# Altium project ADCS.PrjPcb (part 1 of 2)
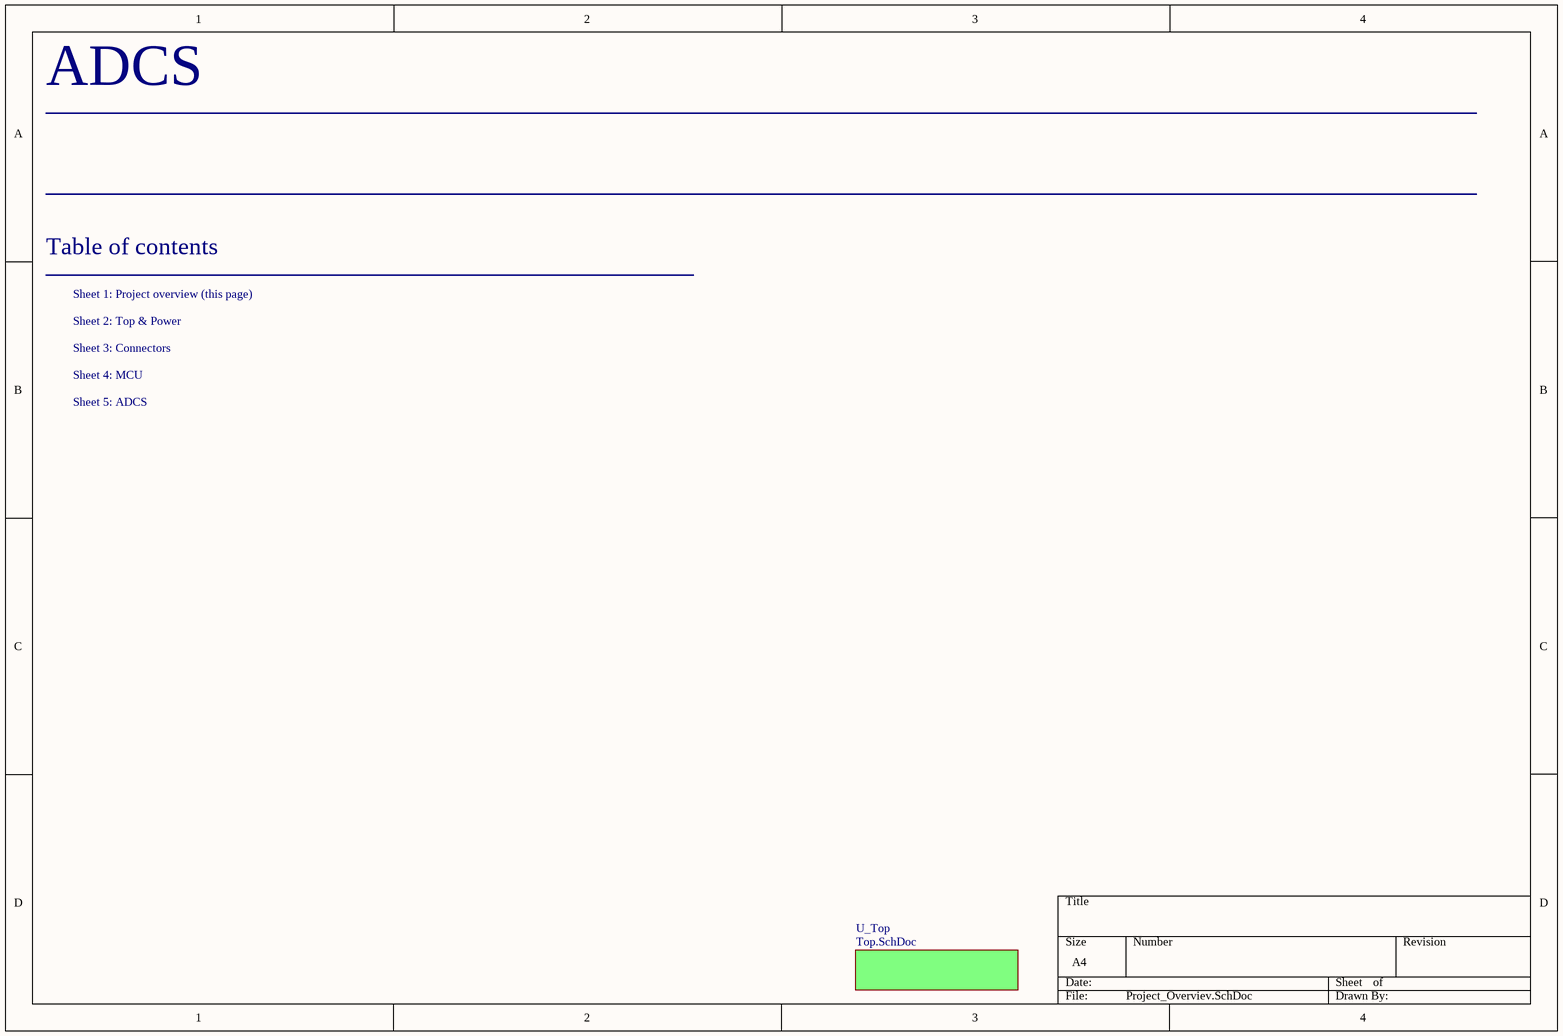
[diagram p0: Project_Overviev.SchDoc]
5 sheets, 100 parts. Net scope: flat (ports and power ports of the same name join across sheets).
Board file: ADCS.PcbDoc
Sheets:
  Project_Overviev.SchDoc
    U_Top = Top.SchDoc
      AOCS_Add-on = ADCS.SchDoc
      ADCS_Connectors = Connectors.SchDoc
      AOCS_MCU_446 = MCU.SchDoc

## Sheet Project_Overviev.SchDoc
size A4; SheetNumber: 1; SheetTotal: 5

### Sub-sheets
U_Top = Top.SchDoc: no entries

### Notes on the sheet
- ADCS
- Table of contents
- Sheet 1: Project overview (this page)
- Sheet 2: Top & Power
- Sheet 3: Connectors
- Sheet 4: MCU
- Sheet 5: ADCS

## Sheet Top.SchDoc
size A4; SheetNumber: 2; SheetTotal: 5
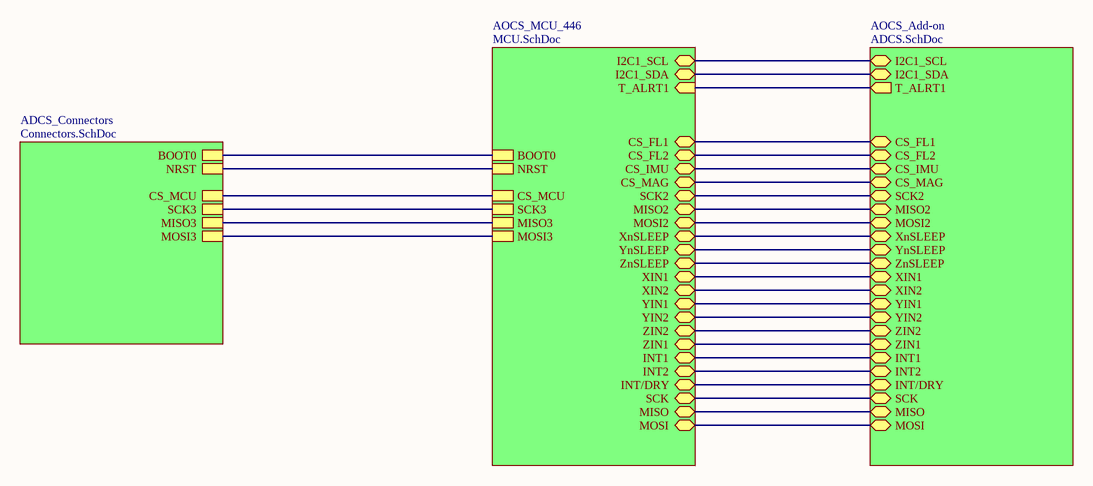
[diagram p1: Top.SchDoc]

### Sub-sheets
ADCS_Connectors = Connectors.SchDoc: NRST, BOOT0, CS_MCU, SCK3, MISO3, MOSI3
AOCS_Add-on = ADCS.SchDoc: I2C1_SCL (bidir), I2C1_SDA (bidir), T_ALRT1 (out), CS_FL2 (bidir), CS_FL1 (bidir), CS_IMU (bidir), CS_MAG (bidir), SCK2 (bidir), MISO2 (bidir), MOSI2 (bidir), YnSLEEP (bidir), XnSLEEP (bidir), ZnSLEEP (bidir), XIN1 (bidir), XIN2 (bidir), YIN1 (bidir), YIN2 (bidir), ZIN2 (bidir), INT2 (bidir), ZIN1 (bidir), INT1 (bidir), INT/DRY (bidir), SCK (bidir), MISO (bidir), MOSI (bidir)
AOCS_MCU_446 = MCU.SchDoc: NRST, BOOT0, I2C1_SCL (bidir), I2C1_SDA (bidir), CS_FL2 (bidir), CS_FL1 (bidir), CS_IMU (bidir), CS_MAG (bidir), SCK2 (bidir), MISO2 (bidir), T_ALRT1 (in), CS_MCU, SCK3, MISO3, MOSI3, MOSI2 (bidir), XnSLEEP (bidir), YnSLEEP (bidir), ZnSLEEP (bidir), XIN1 (bidir), XIN2 (bidir), YIN1 (bidir), YIN2 (bidir), ZIN2 (bidir), INT1 (bidir), ZIN1 (bidir), INT2 (bidir), INT/DRY (bidir), SCK (bidir), MOSI (bidir), MISO (bidir)

### Nets
(unnamed): sheet AOCS_Add-on/I2C1_SCL, sheet AOCS_MCU_446/I2C1_SCL
(unnamed): sheet AOCS_Add-on/I2C1_SDA, sheet AOCS_MCU_446/I2C1_SDA
(unnamed): sheet AOCS_Add-on/T_ALRT1, sheet AOCS_MCU_446/T_ALRT1
(unnamed): sheet AOCS_Add-on/CS_FL2, sheet AOCS_MCU_446/CS_FL2
(unnamed): sheet AOCS_Add-on/CS_FL1, sheet AOCS_MCU_446/CS_FL1
(unnamed): sheet AOCS_Add-on/CS_IMU, sheet AOCS_MCU_446/CS_IMU
(unnamed): sheet AOCS_Add-on/CS_MAG, sheet AOCS_MCU_446/CS_MAG
(unnamed): sheet AOCS_Add-on/SCK2, sheet AOCS_MCU_446/SCK2
(unnamed): sheet AOCS_Add-on/MISO2, sheet AOCS_MCU_446/MISO2
(unnamed): sheet AOCS_Add-on/MOSI2, sheet AOCS_MCU_446/MOSI2
(unnamed): sheet AOCS_Add-on/YnSLEEP, sheet AOCS_MCU_446/YnSLEEP
(unnamed): sheet AOCS_Add-on/XnSLEEP, sheet AOCS_MCU_446/XnSLEEP
(unnamed): sheet AOCS_Add-on/ZnSLEEP, sheet AOCS_MCU_446/ZnSLEEP
(unnamed): sheet AOCS_Add-on/XIN1, sheet AOCS_MCU_446/XIN1
(unnamed): sheet AOCS_Add-on/XIN2, sheet AOCS_MCU_446/XIN2
(unnamed): sheet AOCS_Add-on/YIN1, sheet AOCS_MCU_446/YIN1
(unnamed): sheet AOCS_Add-on/YIN2, sheet AOCS_MCU_446/YIN2
(unnamed): sheet AOCS_Add-on/ZIN2, sheet AOCS_MCU_446/ZIN2
(unnamed): sheet AOCS_Add-on/INT2, sheet AOCS_MCU_446/INT2
(unnamed): sheet AOCS_Add-on/ZIN1, sheet AOCS_MCU_446/ZIN1
(unnamed): sheet AOCS_Add-on/INT1, sheet AOCS_MCU_446/INT1
(unnamed): sheet AOCS_Add-on/INT/DRY, sheet AOCS_MCU_446/INT/DRY
(unnamed): sheet AOCS_Add-on/SCK, sheet AOCS_MCU_446/SCK
(unnamed): sheet AOCS_Add-on/MISO, sheet AOCS_MCU_446/MISO
(unnamed): sheet AOCS_Add-on/MOSI, sheet AOCS_MCU_446/MOSI
(unnamed): sheet ADCS_Connectors/NRST, sheet AOCS_MCU_446/NRST
(unnamed): sheet ADCS_Connectors/BOOT0, sheet AOCS_MCU_446/BOOT0
(unnamed): sheet ADCS_Connectors/CS_MCU, sheet AOCS_MCU_446/CS_MCU
(unnamed): sheet ADCS_Connectors/SCK3, sheet AOCS_MCU_446/SCK3
(unnamed): sheet ADCS_Connectors/MISO3, sheet AOCS_MCU_446/MISO3
(unnamed): sheet ADCS_Connectors/MOSI3, sheet AOCS_MCU_446/MOSI3

## Sheet ADCS.SchDoc
size A4; SheetNumber: 5; SheetTotal: 5
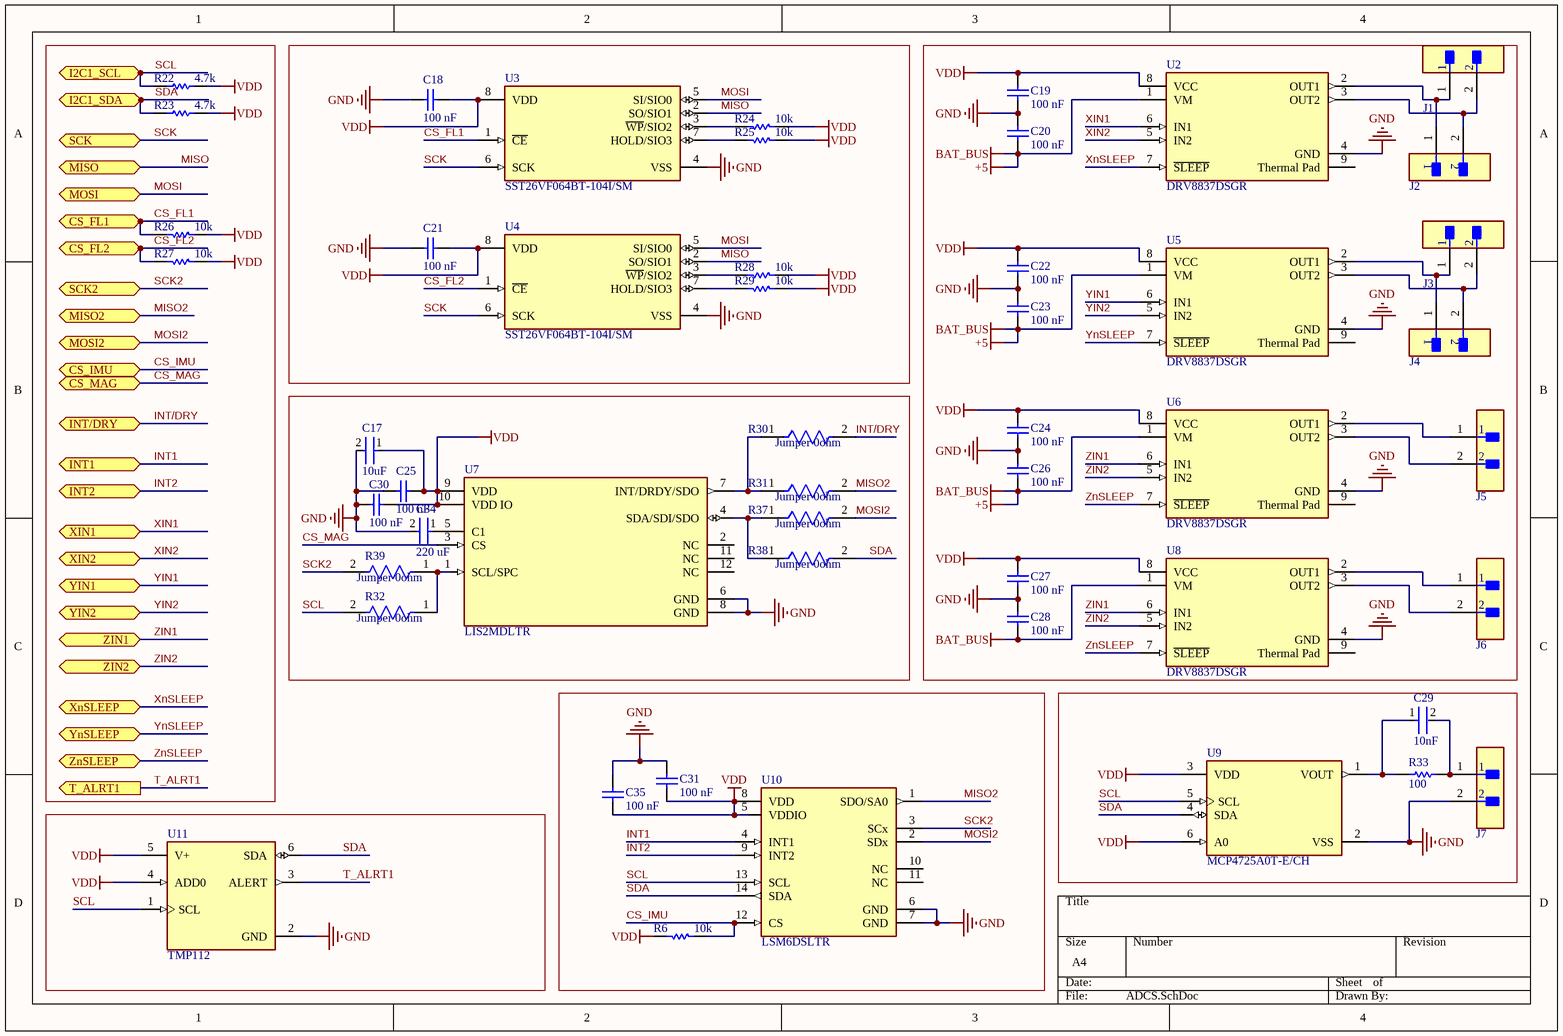
[diagram p2: ADCS.SchDoc]

### Parts
C17  10uF  [FP-CL21B106KOQNNNG-MFG]
C18  100 nF  [CAPC1050X55X23ML05T13]
C19  100 nF  [CAPC1050X55X23ML05T13]
C20  100 nF  [CAPC1050X55X23ML05T13]
C21  100 nF  [CAPC1050X55X23ML05T13]
C22  100 nF  [CAPC1050X55X23ML05T13]
C23  100 nF  [CAPC1050X55X23ML05T13]
C24  100 nF  [CAPC1050X55X23ML05T13]
C25  100 nF  [CAPC1050X55X23ML05T13]
C26  100 nF  [CAPC1050X55X23ML05T13]
C27  100 nF  [CAPC1050X55X23ML05T13]
C28  100 nF  [CAPC1050X55X23ML05T13]
C29  10nF  [FP-CL165-IPC_C]
C30  100 nF  [CAPC1050X55X23ML05T13]
C31  100 nF  [CAPC1050X55X23ML05T13]
C34  220 uF  [FP-C0603C-CF-MFG]
C35  100 nF  [CAPC1050X55X23ML05T13]
J1  B2B-XH-A(LF)(SN)  [FP-B2B-XH-A_LF_SN-MFG]  (value not drawn)
J2  B2B-XH-A(LF)(SN)  [FP-B2B-XH-A_LF_SN-MFG]  (value not drawn)
J3  B2B-XH-A(LF)(SN)  [FP-B2B-XH-A_LF_SN-MFG]  (value not drawn)
J4  B2B-XH-A(LF)(SN)  [FP-B2B-XH-A_LF_SN-MFG]  (value not drawn)
J5  B2B-XH-A(LF)(SN)  [FP-B2B-XH-A_LF_SN-MFG]  (value not drawn)
J6  B2B-XH-A(LF)(SN)  [FP-B2B-XH-A_LF_SN-MFG]  (value not drawn)
J7  B2B-XH-A(LF)(SN)  [FP-B2B-XH-A_LF_SN-MFG]  (value not drawn)
R6  10k  [RESC1005X40X25LL05T05]
R22  4.7k  [RESC1005X40X25LL05T05]
R23  4.7k  [RESC1005X40X25LL05T05]
R24  10k  [RESC1005X40X25LL05T05]
R25  10k  [RESC1005X40X25LL05T05]
R26  10k  [RESC1005X40X25LL05T05]
R27  10k  [RESC1005X40X25LL05T05]
R28  10k  [RESC1005X40X25LL05T05]
R29  10k  [RESC1005X40X25LL05T05]
R30  Jumper 0ohm  [FP-RC1206-MFG]
R31  Jumper 0ohm  [FP-RC1206-MFG]
R32  Jumper 0ohm  [FP-RC1206-MFG]
R33  100  [RESC1608X55X30LL15T15]
R37  Jumper 0ohm  [FP-RC1206-MFG]
R38  Jumper 0ohm  [FP-RC1206-MFG]
R39  Jumper 0ohm  [FP-RC1206-MFG]
U2  DRV8837DSGR  [FP-DSG0008A-MFG]
U3  SST26VF064BT-104I/SM  [FP-C04-056-IPC_A]
U4  SST26VF064BT-104I/SM  [FP-C04-056-IPC_A]
U5  DRV8837DSGR  [FP-DSG0008A-MFG]
U6  DRV8837DSGR  [FP-DSG0008A-MFG]
U7  LIS2MDLTR  [FP-LGA-12-DM00170568-MFG]
U8  DRV8837DSGR  [FP-DSG0008A-MFG]
U9  MCP4725A0T-E/CH  [FP-C04-028-CHY-IPC_A]
U10  LSM6DSLTR  [FP-LGA-14L-DM00249496-MFG]
U11  TMP112  [FP-DRL0006A-MFG]

### Ports
CS_FL1 (bidir, see Top[3B], MCU[2B]), CS_FL2 (bidir, see Top[3B], MCU[2B]), CS_IMU (bidir, see Top[3B], MCU[2B]), CS_MAG (bidir, see Top[3B], MCU[2B]), I2C1_SCL (bidir, see Top[3B], MCU[2B]), I2C1_SDA (bidir, see Top[3B], MCU[2B]), INT1 (bidir, see Top[3C], MCU[3A]), INT2 (bidir, see Top[3C], MCU[3A]), INT/DRY (bidir, see Top[3C], MCU[3A]), MISO2 (bidir, see Top[3B], MCU[2C]), MISO (bidir, see Top[3C], MCU[2A]), MOSI2 (bidir, see Top[3C], MCU[2C]), MOSI (bidir, see Top[3C], MCU[2A]), SCK2 (bidir, see Top[3B], MCU[2B]), SCK (bidir, see Top[3C], MCU[2A]), T_ALRT1 (out, see Top[3B], MCU[3A]), XIN1 (bidir, see Top[3C], MCU[3A]), XIN2 (bidir, see Top[3C], MCU[3A]), XnSLEEP (bidir, see Top[3C], MCU[2A]), YIN1 (bidir, see Top[3C], MCU[3A]), YIN2 (bidir, see Top[3C], MCU[3A]), YnSLEEP (bidir, see Top[3C], MCU[2A]), ZIN1 (bidir, see Top[3C], MCU[2A]), ZIN2 (bidir, see Top[3C], MCU[2A]), ZnSLEEP (bidir, see Top[3C], MCU[2B])

### Nets
+5: C20.1 C23.1 C26.1 C28.1 U2.1(VM) U5.1(VM) U6.1(VM) U8.1(VM)  [also labelled BAT_BUS]
GND: C17.2 C18.1 C19.2 C20.2 C21.1 C22.2 C23.2 C24.2 C25.1 C26.2 C27.2 C28.2 C30.1 C31.2 C34.2 C35.2 J7.2 U2.4(GND) U3.4(VSS) U4.4(VSS) U5.4(GND) U6.4(GND) U7.6(GND) U7.8(GND) U8.4(GND) U9.2(VSS) U10.6(GND) U10.7(GND) U11.2(GND)
VDD: C17.1 C18.2 C19.1 C21.2 C22.1 C24.1 C25.2 C27.1 C30.2 C31.1 C35.1 R6.2 R22.2 R23.2 R24.1 R25.1 R26.1 R27.1 R28.1 R29.1 U2.8(VCC) U3.8(VDD) U4.8(VDD) U5.8(VCC) U6.8(VCC) U7.9(VDD) U7.10(VDD_IO) U8.8(VCC) U9.3(VDD) U9.6(A0) U10.5(VDDIO) U10.8(VDD) U11.4(ADD0) U11.5(V+)
CS_FL1: R26.2 U3.1(~{CE}) ; port CS_FL1
CS_FL2: R27.2 U4.1(~{CE}) ; port CS_FL2
CS_IMU: R6.1 U10.12(CS) ; port CS_IMU
CS_MAG: U7.3(CS) ; port CS_MAG
INT1: U10.4(INT1) ; port INT1
INT2: U10.9(INT2) ; port INT2
INT/DRY: R30.2 ; port INT/DRY
MISO: U3.2(SO/SIO1) U4.2(SO/SIO1) ; port MISO
MISO2: R31.2 U10.1(SDO/SA0) ; port MISO2
MOSI: U3.5(SI/SIO0) U4.5(SI/SIO0) ; port MOSI
MOSI2: R37.2 U10.2(SDx) ; port MOSI2
SCK: U3.6(SCK) U4.6(SCK) ; port SCK
SCK2: R39.2 U10.3(SCx) ; port SCK2
SCL: R22.1 R32.2 U9.5(SCL) U10.13(SCL) U11.1(SCL) ; port I2C1_SCL
SDA: R23.1 R38.2 U9.4(SDA) U10.14(SDA) U11.6(SDA) ; port I2C1_SDA
T_ALRT1: U11.3(ALERT) ; port T_ALRT1
XIN1: U2.6(IN1) ; port XIN1
XIN2: U2.5(IN2) ; port XIN2
XnSLEEP: U2.7(~{SLEEP}) ; port XnSLEEP
YIN1: U5.6(IN1) ; port YIN1
YIN2: U5.5(IN2) ; port YIN2
YnSLEEP: U5.7(~{SLEEP}) ; port YnSLEEP
ZIN1: U6.6(IN1) U8.6(IN1) ; port ZIN1
ZIN2: U6.5(IN2) U8.5(IN2) ; port ZIN2
ZnSLEEP: U6.7(~{SLEEP}) U8.7(~{SLEEP}) ; port ZnSLEEP
NetC29_1: C29.1 R33.1 U9.1(VOUT)
NetC29_2: C29.2 J7.1 R33.2
NetC34_1: C34.1 U7.5(C1)
NetJ1_1: J1.1 J2.1 U2.2(OUT1)
NetJ1_2: J1.2 J2.2 U2.3(OUT2)
NetJ3_1: J3.1 J4.1 U5.2(OUT1)
NetJ3_2: J3.2 J4.2 U5.3(OUT2)
NetJ5_1: J5.1 U6.2(OUT1)
NetJ5_2: J5.2 U6.3(OUT2)
NetJ6_1: J6.1 U8.2(OUT1)
NetJ6_2: J6.2 U8.3(OUT2)
NetR24_2: R24.2 U3.3(~{WP}/SIO2)
NetR25_2: R25.2 U3.7(HOLD/SIO3)
NetR28_2: R28.2 U4.3(~{WP}/SIO2)
NetR29_2: R29.2 U4.7(HOLD/SIO3)
NetR30_1: R30.1 R31.1 U7.7(INT/DRDY/SDO)
NetR32_1: R32.1 R39.1 U7.1(SCL/SPC)
NetR37_1: R37.1 R38.1 U7.4(SDA/SDI/SDO)

Not connected (* = marked no-connect by the designer): U2 9(Thermal_Pad); U5 9(Thermal_Pad); U6 9(Thermal_Pad); U7 2(NC) 11(NC) 12(NC); U8 9(Thermal_Pad); U10 10(NC) 11(NC)

### Library data of the parts
C17 = CMP-13271-000015-1: CAP CER 10UF 16V X7R 0805; Manufacturer Part Number: CL21B106KOQNNNG; Manufacturer: Samsung Electro-Mechanics; Temperature Coefficient: 15%; Tolerance: 10%; Material: Ceramic; ComponentLink2URL: http://product.samsungsem.com/mlcc/CL21B106KOQNNN.do; Package: 0; Voltage Rating: 16V; Value: 10uF; Height: 1.4mm; Temperature Characteristic: X7R; Category: Cap; Lead Free: Yes; RoHS: TRUE; ComponentLink2Description: Datasheet; Octopart: https://octopart.com/cl21b106koqnnng-samsung-19995691; Device Class L1: Passive Components; Temperature Range Low: -55°C; Device Class L3: Ceramic Capacitors; Ipc Land Pattern Name: CAPC200125X125; Digikey Description: CAP CER 10UF 16V X7R 0805; Automotive: No; Capacitance: 10uF; Temperature Range High: +125°C; Device Class L2: Capacitors; Temperature: -55°C to +125°C
C18-C28 C30 C31 C35 = CMP-2000-05439-1: Chip Capacitor, 100 nF, +/- 10%, 16 V, -55 to 125 degC, 0402 (1005 Metric), RoHS, Tape and Reel; Manufacturer: Samsung Electro-Mechanics; Capacitance: 100000pF; Dielectric: X7R; Rated Voltage: 16V; Case Size/Dimension: 0402; Tolerance (%): ±10%; Manufacturer URL: http://www.samsungsem.com/global/index.jsp; Datasheet URL: https://datasheet.ciiva.com/29198/458718-da-01-en-vs-kondensator-0402-29198423.pdf; Datasheet Version: Nov-10
C29 = CMP-13271-000387-1: Cap Ceramic 10nF 50V X7R ±10% SMD 0402 +125°C Paper T/R; Depth: 0.5mm; Length: 1mm; Lead Free: Lead Free; Case Code (Metric): 1005; Width: 0.02inch; Min Operating Temperature: -55°C; Thickness: 0.022inch; Package Quantity: 1; Mount: Surface Mount; Height: 0.5mm; Voltage: 50V; Material: Ceramic; Tolerance: 10%; Case Code (Imperial): 0402; Radiation Hardening: No; Case/Package: 0402; Max Operating Temperature: 125°C; Voltage Rating (DC): 50V; Contact Plating: Tin; Packaging: Tape and Reel; Voltage Rating: 50V; Capacitance: 10nF; Dielectric: X7R
C34 = CMP-03020-018700-1: CAP CER 0603 .22UF 10V X7R 20% A; Manufacturer Part Number: C0603C224M8RACAUTO; Manufacturer: KEMET; Tolerance: 0.2; Automotive Grade: Grade 1; Value: 0.22 μF; Temperature Coefficient: 30ppm/°C; Material: Ceramic; Automotive: Yes; Temperature Characteristic: X7R; Height: 0.87mm; Digikey Description: CAP CER 0603 .22UF 10V X7R 20% A; Lead Free: Yes; Octopart: https://octopart.com/c0603c224m8racauto-kemet-75357852; Package: C0603C-CF; RoHS: TRUE; Category: Cap; Device Class L2: Capacitors; Voltage Rating: 10 V; Temperature Range High: +125°C; Device Class L3: Ceramic Capacitors; ComponentLink2URL: https://api.kemet.com/component-edge/download/datasheet/C0603C100J5GACAUTO.pdf; ComponentLink2Description: Datasheet; Temperature Range Low: -55°C; Capacitance: 0.22 μF; Device Class L1: Passive Components; Temperature: -55°C to +125°C
J1-J7 = CMP-2000-05888-3: CONN HEADER VERT 2POS 2.5MM; Current Rating: 3A; Voltage Rating: 250V; Number of Contacts: 2; Contact Resistance: 20mR; Wire/Cable Gauge: 22AWG; Insulation Resistance: 1GR; Connector Type: Male Pin; Packaging: Bulk; Contact Material: Brass; Lead Free: Lead Free; Orientation: Straight; Contact Plating: Tin; Max Current Rating: 3A; Termination: Solder; Fastening Type: Detent; Depth: 5.75mm; Housing Material: Polyamide; REACH SVHC: No SVHC; Series: XH; Voltage Rating (AC): 250V; Number of Positions: 2; Color: Natural; Contact Type: Male Pin; Max Voltage Rating (DC): 250V; Pitch: 2.5mm; Lead Pitch: 2.5mm; Mount: Through Hole; Max Operating Temperature: 85°C; Length: 7.4mm; Max Voltage Rating (AC): 250V; Min Operating Temperature: -25°C; Number of Rows: 1; Housing Color: White
R6 R24-R29 = CMP-2000-07588-1: Chip Resistor, 10 KOhm, +/- 1%, 0.1 W, -55 to 155 degC, 0402 (1005 Metric), RoHS, Tape and Reel; Manufacturer: Panasonic; Power Rating: 100mW; Voltage Rating: 50V; Resistance: 10KOhm; Case\/Package: 0402; Temperature Coefficient: 100ppm\/degreesC; RoHSCompliant: True; Lead Free: LeadFree; Package Quantity: 1; Contact Plating: Tin; Length: 1mm; Radiation Hardening: No; REACH SVHC: NoSVHC; Max Operating Temperature: 155degC; Depth: 0.5mm; Case Code (Imperial): 0402; Military Standard: Not; Package Description: 2-Pin Surface Mount Device, Body 1 x 0.5 mm; Termination: SMD/SMT; Case Code (Metric): 1005; Height: 0.35mm; Packaging: TapeandReel; Voltage Rating (DC): 50V; Package Reference: 402; Number of Pins: 2; Tolerance: 1%; Mounting Technology: SurfaceMount; Width: 0.02inch; Mount: SurfaceMount; Datasheet URL: https://industrial.panasonic.com/cdbs/www-data/pdf/RDA0000/AOA0000C304.pdf; Composition: ThickFilm; Datasheet Version: 02/2017; Manufacturer URL: http://www.panasonic.com/; Max Power Dissipation: 100mW; Number of Terminations: 2; Min Operating Temperature: -55degC
R22 R23 = CMP-2002-01154-4: Chip Resistor, 4.7 KOhm, +/- 1%, 0.1 W, -55 to 155 degC, 0402 (1005 Metric), RoHS, Tape and Reel; PartNumber: ERJ-2RKF4701X; Voltage Rating: 50 V; Case\/Package: 0402; Power Rating: 100 mW; Height: 0.35 mm; Mounting Technology: Surface Mount; REACH SVHC: Yes; Resistance: 4.7 KOhm; Max Operating Temperature: 155 degC; ComponentLink1Description: Manufacturer URL; ComponentLink2Description: Datasheet; Pins: 2; PackageReference: 0402; Tolerance: 1%; Case Code (Imperial): 0402; Length: 1 mm; PackageDescription: 2-Pin Surface Mount Device, Body 1 x 0.5 mm; RoHSCompliant: true; Package Quantity: 1; Radiation Hardening: No; DatasheetVersion: 04/2015; Width: 0.5 mm; Case Code (Metric): 1005; Mount: Surface Mount; ComponentLink1URL: http://www.panasonic.com/; Min Operating Temperature: -55 degC; Packaging: Cut Tape; ComponentLink2URL: http://industrial.panasonic.com/cdbs/www-data/pdf/RDA0000/AOA0000C86.pdf
R30-R32 R37-R39 = CMP-2100-03681-2: RES SMD 0 OHM JUMPER 1/4W 1206; Manufacturer Part Number: RC1206JR-070RL; Manufacturer: YAGEO; Voltage Rating: 200V; Temperature Coefficient: 300ppm/°C; Power Rating: 0.25W; Value: 0Ω; Tolerance: 5%; Temperature Range Low: -55°C; Category: Res; Automotive: No; Ipc Land Pattern Name: RESC310160X55; Device Class L1: Passive Components; Temperature: -55°C to +155°C; ComponentLink2URL: https://www.yageo.com/upload/media/product/productsearch/datasheet/rchip/PYu-RC_Group_51_RoHS_L_10.pdf; Lead Free: Yes; Height: 0.65mm; Footprint Url: https://www.yageo.com/upload/website/yageo_PYu-R_Mount_10_19050818_343.pdf; Package: RC1206; Digikey Description: RES SMD 0 OHM JUMPER 1/4W 1206; Temperature Range High: +155°C; Device Class L3: Chip SMD Resistors; Device Class L2: Resistors; Octopart: https://octopart.com/rc1206jr-070rl-yageo-40025601; Resistance: 0Ω; Series: RC; ComponentLink2Description: Datasheet; Composition: Thick Film; RoHS: TRUE; Mouser Description: Resistor: thick film; SMD; 1206; 0O; 0.25W; ±5%; -55÷155°C
R33 = CMP-2000-00179-1: Manufacturer: Panasonic; Part Number: ERJ-3EKF1000V
U2 U5 U6 U8 = CMP-04915-000004-1: IC MOTOR DRIVER PAR 8WSON; Manufacturer: Texas Instruments; Switching Frequency: 0-250kHz; Min Supply Voltage: 1.8V; Standoff Height: 0mm; Max Supply Voltage: 7V; Output Voltage: 0-11V; Motor Type: Brushed; Number Of Outputs: 2; Output Current: 1.8A; Max Junction Temp: +150°C; Nominal Supply Current: 300-700uA; Mouser Description: Motor / Motion / Ignition Controllers & Drivers 1.8A Low Vltg Brush DC Motor Driver; Device Class L2: Power Management ICs; Manufacturer Part Number: DRV8837DSGR; Temperature Range Low: -40°C; Lead Free: Yes; Height: 0.8mm; Device Class L3: Motor Drivers; Octopart: https://octopart.com/drv8837dsgr-texas+instruments-23786726; Package: DSG0008A; ComponentLink2URL: http://www.ti.com/lit/ds/symlink/drv8837.pdf; Temperature: -40°C to +85°C; Ambient Temperature Range Low: -40°C; ComponentLink2Description: Datasheet; Ambient Temperature Range High: +85°C; Device Class L1: Integrated Circuits (ICs); Category: IC; Temperature Range High: +85°C; RoHS: TRUE; Automotive: No; Digikey Description: IC MOTOR DRIVER PAR 8WSON
U3 U4 = CMP-06315-000009-1: IC FLASH 64M SPI 104MHZ 8SOIJ; Density: 64Mb; Page Size: 256B; Operating Supply Voltage: 3V; Interface: SPI; Frequency: 104MHz; Packaging: Tape and Reel; Max Operating Temperature: 85°C; Case/Package: SOIC; Number of Pins: 8; Min Operating Temperature: -40°C; Lead Free: Lead Free; Memory Type: FLASH
U7 = CMP-12173-000002-1: SENSOR MR I2C/SPI 12LGA; Manufacturer: STMicroelectronics; Sensing Method: Magnetic; Min Supply Voltage: 1.71V; Sensor Output: I2C,SPI; Operating Supply Current: 50-200uA; Max Supply Voltage: 3.6V; Octopart: https://octopart.com/lis2mdltr-stmicroelectronics-81117311; RoHS: TRUE; Device Class L3: unset; Device Class L1: Sensors; ComponentLink2URL: https://www.st.com/resource/en/datasheet/lis2mdl.pdf; Automotive: No; Device Class L2: Magnetic Sensors; Lead Free: Yes; Temperature: -40°C to +85°C; Manufacturer Part Number: LIS2MDLTR; Temperature Range High: +85°C; Height: 0.7mm; Digikey Description: SENSOR MR I2C/SPI 12LGA; Category: IC; ComponentLink2Description: Datasheet; Package: LGA-12-DM00170568; Temperature Range Low: -40°C
U9 = CMP-0188-00760-3: IC DAC 12BIT V-OUT SOT23-6; Number of Outputs: 1; Supply Type: Single; Integral Nonlinearity (INL): 14.5LSB; Polarity: Unipolar; Number of Bits: 12; Min Supply Voltage: 2.7V; Output Type: Voltage; Settling Time: 6us; Max Supply Voltage: 5.5V; Nominal Supply Current: 210uA; Resolution: 12b; Interface: I2C; Input Offset Voltage (Vos): 1.1mV; Radiation Hardening: No; Number of DAC Channels: 1; Length: 3.1mm; Number of D/A Converters: 1; Number of Pins: 6; Case/Package: SOT-23-6; Lead Free: Lead Free; Number of Channels: 1; Termination: SMD/SMT; Width: 1.8mm; Contact Plating: Tin; Package Quantity: 3000; Max Operating Temperature: 125°C; Min Operating Temperature: -40°C; REACH SVHC: No SVHC; Mount: Surface Mount; Height: 1.3mm; Packaging: Tape and Reel; Number of Converters: 1
U10 = CMP-2000-07467-2: IMU ACCEL/GYRO I2C/SPI 14LGA; Manufacturer: STMicroelectronics; Resolution: 16bits; Max Supply Voltage: 3.6V; Sensor Type: Temperature,Accelerometer,Gyroscope; Sensor Output: I2C,SPI; Gyro Range: 125/250/500/1000/2000°/s; Accel Range: 2/4/8/16g; Operating Supply Current: 0.29-0.65mA; Min Supply Voltage: 1.62V; Package: LGA-14L-DM00249496; Temperature Range High: +85°C; Automotive: No; Footprint Url: https://www.st.com/resource/en/technical_note/cd00134799.pdf; Height: 0.86mm; Device Class L1: Sensors; Octopart: https://octopart.com/lsm6dsltr-stmicroelectronics-66358193; Device Class L2: Motion Sensors; Lead Free: Yes; Category: IC; Device Class L3: Inertial Measurement Units (IMUs); ComponentLink2Description: Datasheet; RoHS: TRUE; ComponentLink2URL: https://www.st.com/resource/en/datasheet/lsm6dsl.pdf; Temperature Range Low: -40°C; Manufacturer Part Number: LSM6DSLTR; Mouser Description: iNEMO inertial module: always-on 3D accelerometer and 3D gyroscope; Digikey Description: IMU ACCEL/GYRO I2C/SPI 14LGA; Temperature: -40°C to +85°C
U11 = CMP-04948-000024-1: SENSOR DIGITAL -40C-125C 6SOT / TMP112AIDRLR, NOT AQDRLRQ1; Manufacturer: Texas Instruments; Manufacturer Part Number: TMP112AQDRLRQ1; Resolution: 12bits; Automotive Grade: Grade 1; Standoff Height: 0mm; Max Junction Temp: +150°C; Max Supply Voltage: 3.6V; Min Supply Voltage: 1.4V; Output Voltage: 5V; Interface: I2C,2-Wire,SMBus; Sensor Output: I2C,SMBus; Operating Supply Current: 7-85uA; Temperature Range Low: -40°C; Device Class L2: Temperature and Humidity Sensors; Height: 0.6mm; Automotive: Yes; Temperature Range High: +125°C; Category: IC; RoHS: TRUE; Lead Free: Yes; Ambient Temperature Range High: +125°C; Ambient Temperature Range Low: -40°C; Octopart: https://octopart.com/tmp112aqdrlrq1-texas+instruments-50418097; Ipc Land Pattern Name: SOTFL50P160X60-6; Device Class L1: Sensors; Device Class L3: unset; Digikey Description: SENSOR DIGITAL -40C-125C 6SOT; Mouser Description: Temp Sensor Digital Serial (2-Wire, I2C) Automotive 6-Pin SOT-563 T/R; Temperature: -40°C to +125°C; ComponentLink2Description: Datasheet; ComponentLink2URL: http://www.ti.com/lit/ds/symlink/tmp112-q1.pdf; Package: DRL0006A

## Sheet Connectors.SchDoc
size A4; SheetNumber: 3; SheetTotal: 5
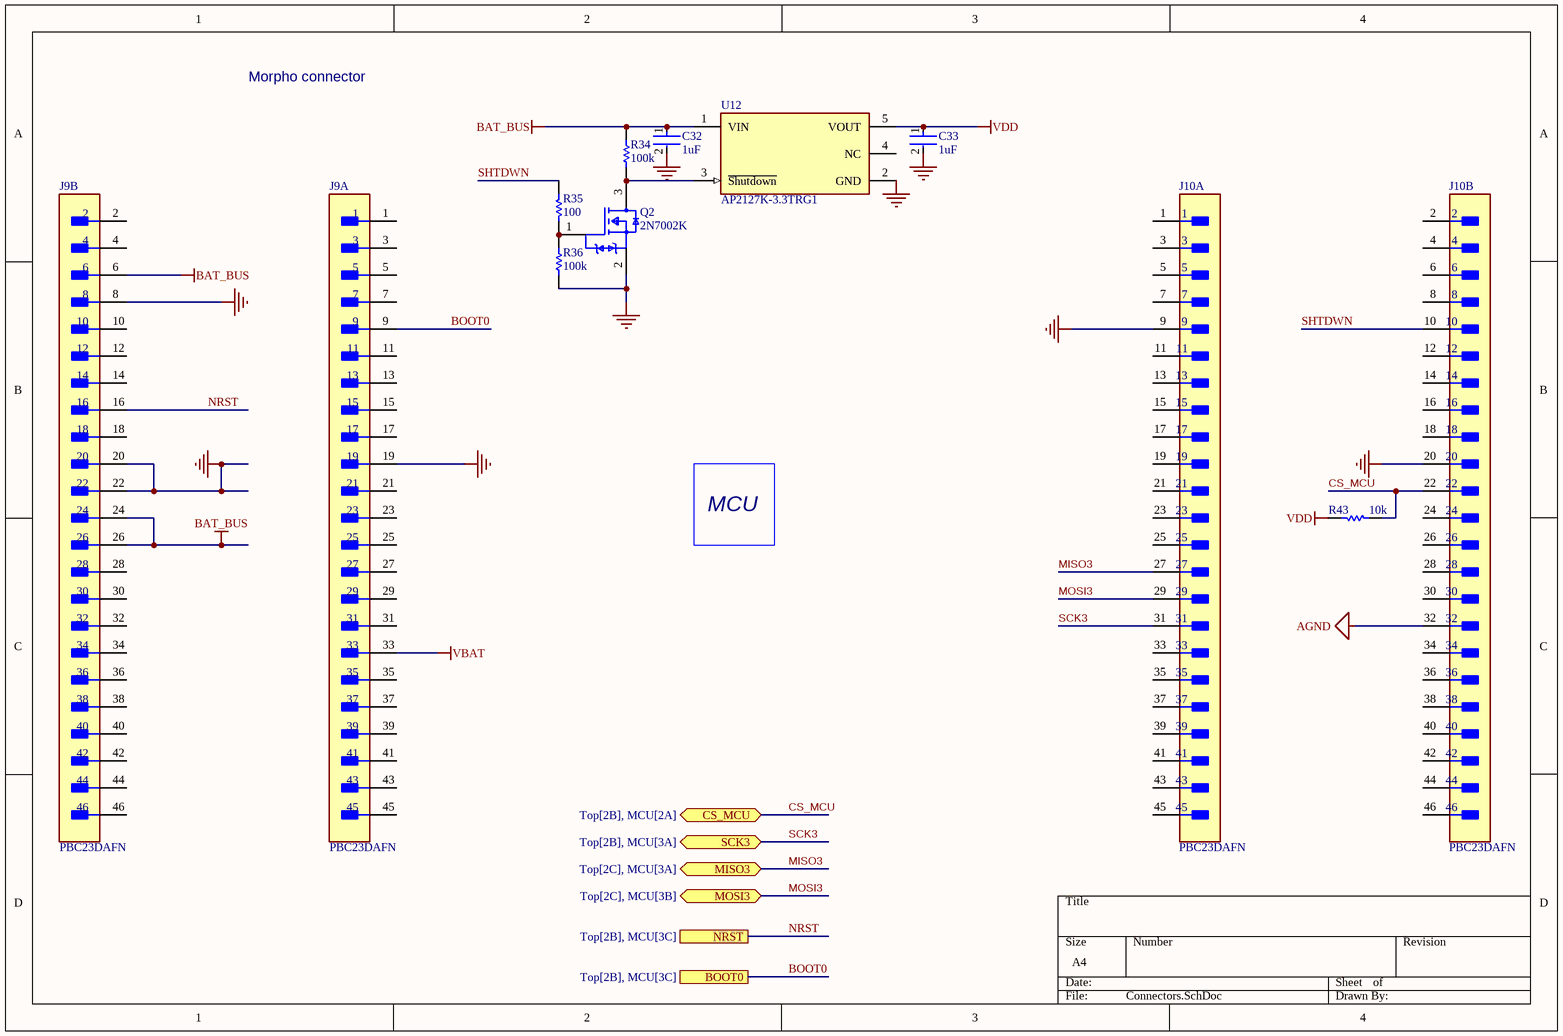
[diagram p3: Connectors.SchDoc]

### Parts
C32  1uF  [FP-0603-L_1_6_0_15-W_0_81-IPC_B]
C33  1uF  [FP-0603-L_1_6_0_15-W_0_81-IPC_B]
J9  PBC23DAFN  [FP-PBC23DAFN-MFG]  (parts A,B of 2)
J10  PBC23DAFN  [FP-PBC23DAFN-MFG]  (parts A,B of 2)
Q2  2N7002K  [FP-318-08-MFG]
R34  100k  [RESC1005X40X25NL05T10]
R35  100  [RESC1608X55X30LL15T15]
R36  100k  [RESC1005X40X25NL05T10]
R43  10k  [RESC1005X40X25LL05T05]
U12  AP2127K-3.3TRG1  [FP-SOT25-MFG]

### Ports
BOOT0 (see Top[2B], MCU[3C]), CS_MCU (bidir, see Top[2B], MCU[2A]), MISO3 (bidir, see Top[2C], MCU[3A]), MOSI3 (bidir, see Top[2C], MCU[3B]), NRST (see Top[2B], MCU[3C]), SCK3 (bidir, see Top[2B], MCU[3A])

### Nets
AGND: J10.32
BAT_BUS: C32.1 J9.6 J9.24 J9.26 R34.2 U12.1(VIN)  [project net +5]
GND: C32.2 C33.2 J9.8 J9.19 J9.20 J9.22 J10.9 J10.20 Q2.2(Source) R36.1 U12.2(GND)
VBAT: J9.33
VDD: C33.1 R43.2 U12.5(VOUT)
BOOT0: J9.9 ; port BOOT0
CS_MCU: J10.22 R43.1 ; port CS_MCU
MISO3: J10.27 ; port MISO3
MOSI3: J10.29 ; port MOSI3
NRST: J9.16 ; port NRST
SCK3: J10.31 ; port SCK3
SHTDWN: J10.10 R35.2
NetQ2_1: Q2.1(Gate) R35.1 R36.2
NetQ2_3: Q2.3(Drain) R34.1 U12.3(~{Shutdown})

Not connected (* = marked no-connect by the designer): J9 1 2 3 4 5 7 10 11 12 13 14 15 17 18 21 23 25 27 28 29 30 31 32 34 35 36 37 38 39 40 41 42 43 44 45 46; J10 1 2 3 4 5 6 7 8 11 12 13 14 15 16 17 18 19 21 23 24 25 26 28 30 33 34 35 36 37 38 39 40 41 42 43 44 45 46; U12 4(NC)

### Notes on the sheet
- Morpho connector
- MCU

### Library data of the parts
C32 C33 = CMP-2006-04532-2: General Purpose Ceramic Capacitor, 0603, 1uF, 10%, X5R, 15%, 16V; Dissipation Factor: 12.5%; Insulation Resistance: 10GR; Case/Package: 0603; Depth: 0.81mm; Max Operating Temperature: 85°C; Number of Pins: 2; Thickness: 0.035inch; Packaging: Tape and Reel; RoHS Compliant: Yes; Construction: Flat; Mount: Surface Mount; Width: 0.81mm; Case Code (Metric): 1608; Voltage Rating (DC): 16V; Voltage: 16V; Height: 0.9mm; Capacitance: 1uF; Length: 1.6mm; Dielectric: X5R; Voltage Rating: 16V; Radiation Hardening: No; Series: -; Case Code (Imperial): 0603; Tolerance: 10%; Lead Free: Lead Free; Termination: SMD/SMT; Min Operating Temperature: -55°C; Package Quantity: 1; REACH SVHC: No SVHC
J9 J10 = CMP-25680-000057-1: CONN HEADER VERT 46POS 2.54MM; Connector Type: Male Pin; Gender: Male; Number of Contacts: 46; Pitch: 0.1inch; Mount: Through Hole; Height: 2.54mm; Housing Material: Plastic; Contact Plating: Gold; Length: 58.4mm; RoHS Compliant: Yes; Packaging: Bulk; Termination: Solder; Number of Rows: 2; Series: -; Lead Free: Lead Free; Row Spacing: 0.1inch; Contact Type: Male Pin; Contact Material: Bronze; Color: Black; Number of Positions: 46; Width: 5.08mm; Contact Mating Length: 0.23inch; Package Quantity: 1; Housing Color: Black
Q2 = CMP-07173-000009-1: MOSFET N-CH 60V 300MA SOT23; Manufacturer: ON Semiconductor; Turn Off Delay Time: 55.8ns; Max Forward Diode Voltage: 1.2V; Max Junction Temp: +150°C; Pulse Drain Current: 5A; Threshold Vgs Min: 1V; Depletion Mode: False; Drain To Source Resistance: 1.19Ω; Number Of N Channels: 1; Standoff Height: 0.01mm; Rthja Max: 417°C/W; Input Capacitace At Vds: 24.5pF @ 20V; Threshold Vgs Max: 2.3V; Turn On Delay Time: 12.2ns; Gate Charge At Vgs: 0.7nC @ 4.5V; Continuous Drain Current: 320mA; Transconductance: 0.53S; Power Dissipation: 300mW; Gate To Source Voltage: 20V; Typ Forward Diode Voltage: 0.8V; ComponentLink2URL: https://www.onsemi.com/pub/Collateral/2N7002K-D.pdf; RoHS: TRUE; Device Class L1: Discrete Semiconductors; ComponentLink2Description: Datasheet; Manufacturer Part Number: 2N7002K; Octopart: https://octopart.com/2n7002k-on+semiconductor-84408900; Device Class L3: MOSFETs; Mouser Description: N-Channel 60 V 2 Ohm SMT Enhancement Mode Field Effect Transistor SOT-23; Ipc Land Pattern Name: SOT95P240X100-3; Temperature Range High: +150°C; Temperature Range Low: -55°C; Lead Free: Yes; Height: 1.11mm; Package: 318-08; Footprint Url: https://www.onsemi.com/pub/Collateral/318-08.PDF; Temperature: -55°C to +150°C; Drain To Source Voltage: 60V; Device Class L2: Transistors; Drain To Source Breakdown Voltage: 60V; Digikey Description: MOSFET N-CH 60V 300MA SOT23; Number Of Channels: 1; Category: Trans; Automotive: No
R34 R36 = CMP-2002-07343-1: Part Number: RC0402FR-07100KL; Manufacturer: Yageo / Phycomp
R35 = CMP-2000-00179-1: as R33 on sheet ADCS
R43 = CMP-2000-07588-1: as R6 on sheet ADCS; RoHSCompliant: True; Lead Free: LeadFree; Package Quantity: 1; Contact Plating: Tin; Length: 1mm; Radiation Hardening: No; REACH SVHC: NoSVHC; Max Operating Temperature: 155degC; Depth: 0.5mm; Case Code (Imperial): 0402; Military Standard: Not; Package Description: 2-Pin Surface Mount Device, Body 1 x 0.5 mm; Termination: SMD/SMT; Case Code (Metric): 1005; Height: 0.35mm; Packaging: TapeandReel; Voltage Rating (DC): 50V; Package Reference: 402; Number of Pins: 2; Tolerance: 1%; Mounting Technology: SurfaceMount; Width: 0.02inch; Mount: SurfaceMount; Datasheet URL: https://industrial.panasonic.com/cdbs/www-data/pdf/RDA0000/AOA0000C304.pdf; Composition: ThickFilm; Datasheet Version: 02/2017; Manufacturer URL: http://www.panasonic.com/; Max Power Dissipation: 100mW; Number of Terminations: 2; Min Operating Temperature: -55degC
U12 = CMP-12756-000001-1: IC REG LINEAR 3.3V 300MA SOT23-5; Manufacturer: Diodes Inc.; Output Type: Fixed; Max Junction Temp: +150°C; Max Supply Voltage: 6V; Nominal Supply Current: 60uA; Standoff Height: 0.013mm; Min Supply Voltage: 2.5V; Dropout Voltage: 170mV; Number Of Outputs: 1; Accuracy Percentage: 2%; Output Current: 400mA; Temperature Range Low: -40°C; Octopart: https://octopart.com/ap2127k-3.3trg1-diodes+inc.-30954597; Automotive: No; Mouser Description: LDO Voltage Regulators 300mA CMOS LDO 2.5V to 6V; Device Class L3: Voltage Regulators - Linear; Height: 1.4mm; Ambient Temperature Range Low: -40°C; Output Voltage: 3.3V; ComponentLink2Description: Datasheet; RoHS: TRUE; Digikey Description: IC REG LINEAR 3.3V 300MA SOT23-5; Device Class L1: Integrated Circuits (ICs); Device Class L2: Power Management ICs; Footprint Url: https://www.diodes.com/assets/Package-Files/SOT25.pdf; Temperature: -40°C to +85°C; Category: IC; Lead Free: Yes; Temperature Range High: +85°C; Manufacturer Part Number: AP2127K-3.3TRG1; Ambient Temperature Range High: +85°C; Package: SOT25; ComponentLink2URL: https://www.diodes.com/assets/Datasheets/AP2127.pdf

## Sheet MCU.SchDoc
size A4; SheetNumber: 4; SheetTotal: 5
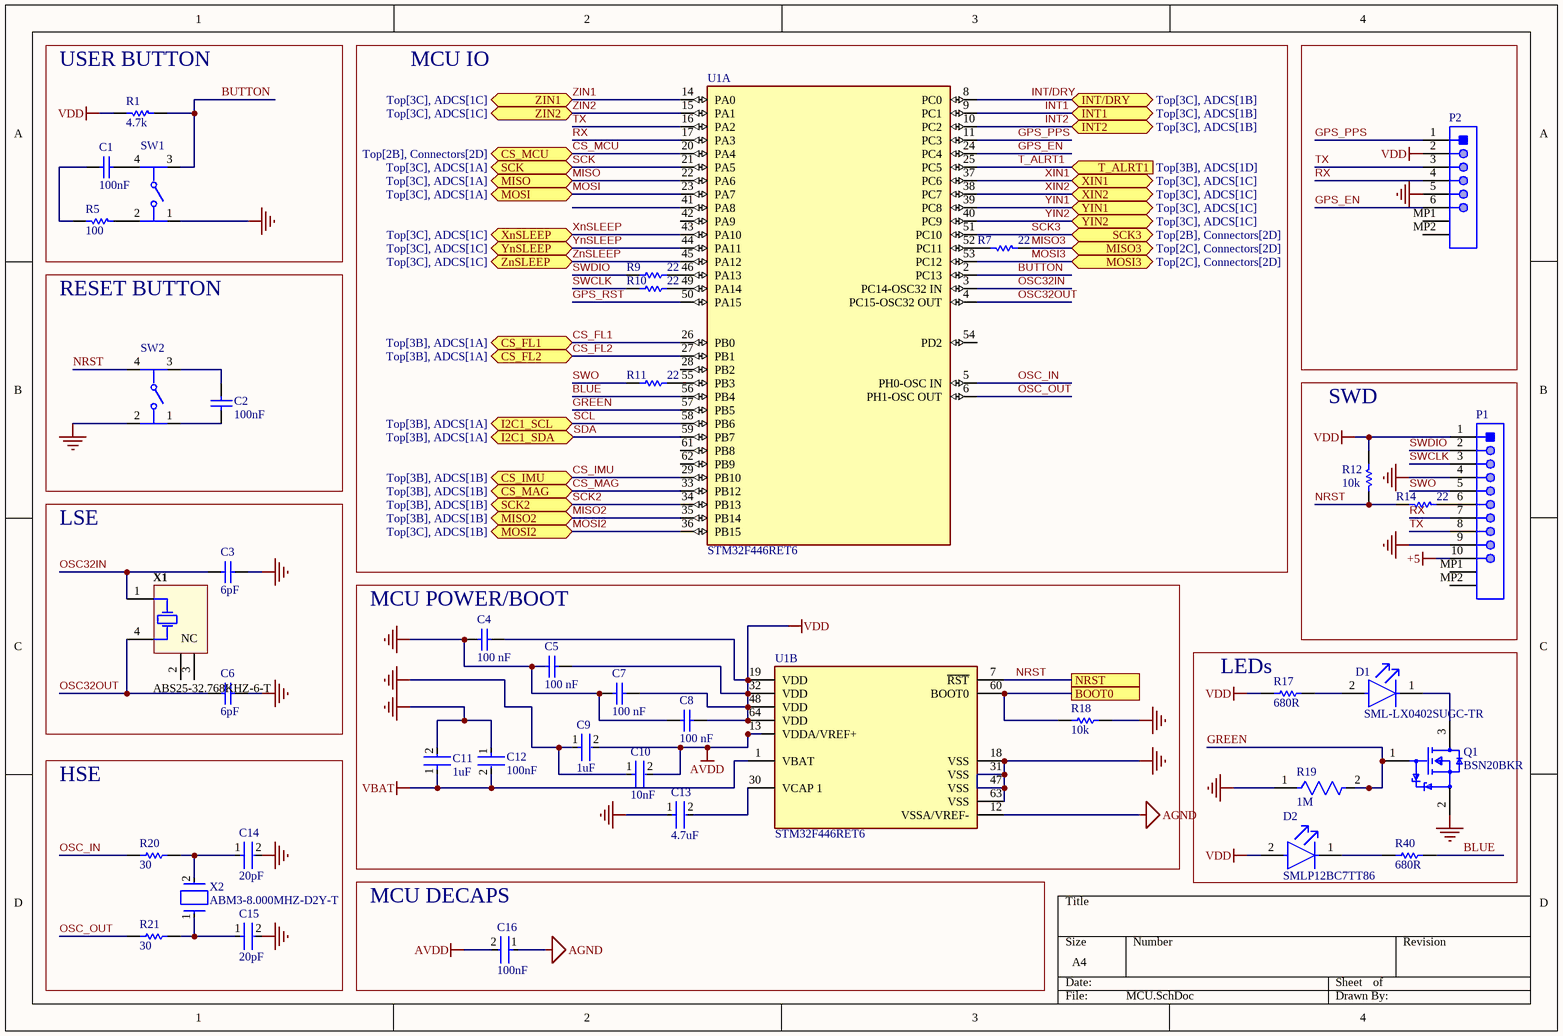
[diagram p4: MCU.SchDoc]

### Parts
C1  100nF  [CAPC1050X55X23ML05T13]
C2  100nF  [CAPC1050X55X23ML05T13]
C3  6pF  [CAPC1005X55X25ML05T10]
C4  100 nF  [CAPC1050X55X23ML05T13]
C5  100 nF  [CAPC1050X55X23ML05T13]
C6  6pF  [CAPC1005X55X25ML05T10]
C7  100 nF  [CAPC1050X55X23ML05T13]
C8  100 nF  [CAPC1050X55X23ML05T13]
C9  1uF  [FP-CL10-IPC_A]
C10  10nF  [FP-CL165-IPC_C]
C11  1uF  [FP-CL10-IPC_C]
C12  100nF  [FP-CC0402-MFG]
C13  4.7uF  [FP-CC0805-0_85-MFG]
C14  20pF  [FP-CC0603-0_9-MFG]
C15  20pF  [FP-CC0603-0_9-MFG]
C16  100nF  [FP-CC0402-MFG]
D1  SML-LX0402SUGC-TR  [FP-SML-LX0402SUGC-TR-MFG]
D2  SMLP12BC7TT86  [FP-SML-P12-MFG]
P1  SM10B-SHLS-TF(LF)(SN)  [JST-SM10B-SHLS-TF_V]  (value not drawn)
P2  SM06B-SRSS-TB(LF)(SN)  [JST-SM06B-SRSS-TB_V]  (value not drawn)
Q1  BSN20BKR  [FP-SOT23-IPC_C]
R1  4.7k  [RESC1005X40X25LL05T05]
R5  100  [RESC1608X55X30LL15T15]
R7  22  [RESC1608X55X25NL10T15]
R9  22  [RESC1005X40X25ML05T05]
R10  22  [RESC1005X40X25ML05T05]
R11  22  [RESC1005X40X25ML05T05]
R12  10k  [RESC1005X40X25LL05T10]
R14  22  [RESC1608X55X25NL10T15]
R17  680R  [RESC1005X40X25ML05T05]
R18  10k  [RESC1005X40X25LL05T05]
R19  1M  [FP-MCR01-IPC_B]
R20  30  [RESC1609X50X30NL10T20]
R21  30  [RESC1609X50X30NL10T20]
R40  680R  [RESC1005X40X25ML05T05]
SW1  PTS810SJM250SMTRLFS  [FP-PTS810SJM250SMTRLFS-MFG]  (value not drawn)
SW2  PTS810SJM250SMTRLFS  [FP-PTS810SJM250SMTRLFS-MFG]  (value not drawn)
U1  STM32F446RET6  [FP-LQFP64-5W-MFG]  (parts A,B of 2)
X1  ABS25-32.768KHZ-6-T  [ABRA-ABS25-4_V]
X2  ABM3-8.000MHZ-D2Y-T  [FP-ABM3-MFG]

### Blocks framed on the sheet
USER BUTTON: C1 R1 R5 SW1
MCU IO: R7 R9-R11 U1
RESET BUTTON: C2 SW2
SWD: P1 R12 R14
LSE: C3 C6 X1
MCU POWER/BOOT: C4 C5 C7-C13 R18 U1
LEDs: D1 D2 Q1 R17 R19 R40
HSE: C14 C15 R20 R21 X2
MCU DECAPS: C16

### Ports
BOOT0 (see Top[2B], Connectors[2D]), CS_FL1 (bidir, see Top[3B], ADCS[1A]), CS_FL2 (bidir, see Top[3B], ADCS[1A]), CS_IMU (bidir, see Top[3B], ADCS[1B]), CS_MAG (bidir, see Top[3B], ADCS[1B]), CS_MCU (bidir, see Top[2B], Connectors[2D]), I2C1_SCL (bidir, see Top[3B], ADCS[1A]), I2C1_SDA (bidir, see Top[3B], ADCS[1A]), INT1 (bidir, see Top[3C], ADCS[1B]), INT2 (bidir, see Top[3C], ADCS[1B]), INT/DRY (bidir, see Top[3C], ADCS[1B]), MISO2 (bidir, see Top[3B], ADCS[1B]), MISO3 (bidir, see Top[2C], Connectors[2D]), MISO (bidir, see Top[3C], ADCS[1A]), MOSI2 (bidir, see Top[3C], ADCS[1B]), MOSI3 (bidir, see Top[2C], Connectors[2D]), MOSI (bidir, see Top[3C], ADCS[1A]), NRST (see Top[2B], Connectors[2D]), SCK2 (bidir, see Top[3B], ADCS[1B]), SCK3 (bidir, see Top[2B], Connectors[2D]), SCK (bidir, see Top[3C], ADCS[1A]), T_ALRT1 (in, see Top[3B], ADCS[1D]), XIN1 (bidir, see Top[3C], ADCS[1C]), XIN2 (bidir, see Top[3C], ADCS[1C]), XnSLEEP (bidir, see Top[3C], ADCS[1C]), YIN1 (bidir, see Top[3C], ADCS[1C]), YIN2 (bidir, see Top[3C], ADCS[1C]), YnSLEEP (bidir, see Top[3C], ADCS[1C]), ZIN1 (bidir, see Top[3C], ADCS[1C]), ZIN2 (bidir, see Top[3C], ADCS[1C]), ZnSLEEP (bidir, see Top[3C], ADCS[1C])

### Nets
+5: P1.10
AGND: C16.1 U1.12(VSSA/VREF-)
AVDD: C9.2 C10.2 C16.2 U1.13(VDDA/VREF+)
GND: C3.2 C4.1 C5.1 C6.2 C7.1 C8.1 C9.1 C10.1 C11.2 C12.1 C13.1 C14.2 C15.2 P1.4 P1.9 P2.5 Q1.2(S) R18.1 R19.1 SW1.1 SW2.2 U1.18(VSS) U1.31(VSS) U1.47(VSS) U1.63(VSS)
VBAT: C11.1 C12.2 U1.1(VBAT)
VDD: C4.2 C5.2 C7.2 C8.2 D2.2(A) P1.1 P2.2 R1.2 R12.1 R17.1 U1.19(VDD) U1.32(VDD) U1.48(VDD) U1.64(VDD)
BLUE: R40.2 U1.56(PB4)
BOOT0: R18.2 U1.60(BOOT0) ; port BOOT0
BUTTON: R1.1 SW1.3 U1.2(PC13)
CS_FL1: U1.26(PB0) ; port CS_FL1
CS_FL2: U1.27(PB1) ; port CS_FL2
CS_IMU: U1.29(PB10) ; port CS_IMU
CS_MAG: U1.33(PB12) ; port CS_MAG
CS_MCU: U1.20(PA4) ; port CS_MCU
GPS_EN: P2.6 U1.24(PC4)
GPS_PPS: P2.1 U1.11(PC3)
GPS_RST: U1.50(PA15)
GREEN: Q1.1(G) R19.2 U1.57(PB5)
INT1: U1.9(PC1) ; port INT1
INT2: U1.10(PC2) ; port INT2
INT/DRY: U1.8(PC0) ; port INT/DRY
MISO: U1.22(PA6) ; port MISO
MISO2: U1.35(PB14) ; port MISO2
MISO3: R7.1 ; port MISO3
MOSI: U1.23(PA7) ; port MOSI
MOSI2: U1.36(PB15) ; port MOSI2
MOSI3: U1.53(PC12) ; port MOSI3
NRST: R12.2 R14.2 SW2.4 U1.7(~{RST}) ; port NRST
OSC32IN: C3.1 U1.3(PC14-OSC32_IN) X1.1(X1)
OSC32OUT: C6.1 U1.4(PC15-OSC32_OUT) X1.4(X2)
OSC_IN: R20.1 U1.5(PH0-OSC_IN)
OSC_OUT: R21.1 U1.6(PH1-OSC_OUT)
RX: P1.7 P2.4 U1.17(PA3)
SCK: U1.21(PA5) ; port SCK
SCK2: U1.34(PB13) ; port SCK2
SCK3: U1.51(PC10) ; port SCK3
SCL: U1.58(PB6) ; port I2C1_SCL
SDA: U1.59(PB7) ; port I2C1_SDA
SWCLK: P1.3 R10.1
SWDIO: P1.2 R9.1
SWO: P1.5 R11.1
T_ALRT1: U1.25(PC5) ; port T_ALRT1
TX: P1.8 P2.3 U1.16(PA2)
XIN1: U1.37(PC6) ; port XIN1
XIN2: U1.38(PC7) ; port XIN2
XnSLEEP: U1.43(PA10) ; port XnSLEEP
YIN1: U1.39(PC8) ; port YIN1
YIN2: U1.40(PC9) ; port YIN2
YnSLEEP: U1.44(PA11) ; port YnSLEEP
ZIN1: U1.14(PA0) ; port ZIN1
ZIN2: U1.15(PA1) ; port ZIN2
ZnSLEEP: U1.45(PA12) ; port ZnSLEEP
NetC1_1: C1.1 SW1.4
NetC1_2: C1.2 R5.2
NetC2_1: C2.1 SW2.1
NetC2_2: C2.2 SW2.3
NetC13_2: C13.2 U1.30(VCAP_1)
NetC14_1: C14.1 R20.2 X2.2
NetC15_1: C15.1 R21.2 X2.1
NetD1_1: D1.1(C) Q1.3(D)
NetD1_2: D1.2(A) R17.2
NetD2_1: D2.1(C) R40.1
NetP1_6: P1.6 R14.1
NetR5_1: R5.1 SW1.2
NetR7_2: R7.2 U1.52(PC11)
NetR9_2: R9.2 U1.46(PA13)
NetR10_2: R10.2 U1.49(PA14)
NetR11_2: R11.2 U1.55(PB3)

Not connected (* = marked no-connect by the designer): P1 MP1 MP2; P2 MP1 MP2; U1 28(PB2) 41(PA8) 42(PA9) 54(PD2) 61(PB8) 62(PB9); X1 2(NC) 3(NC)

### Library data of the parts
C1 C2 C4 C5 C7 C8 = CMP-2000-05439-1: as C18 on sheet ADCS; Case Size/Dimension: 0402; Tolerance (%): ±10%; Manufacturer URL: http://www.samsungsem.com/global/index.jsp; Datasheet URL: https://datasheet.ciiva.com/29198/458718-da-01-en-vs-kondensator-0402-29198423.pdf; Datasheet Version: Nov-10
C3 C6 = CMP-2008-04413-1: Part Number: GRM1555C1H6R0DA01D; Manufacturer: Murata
C9 = CMP-13271-001457-1: Cap Ceramic 1uF 16V X5R ±10% Pad SMD 0603 +85°C T/R; Dielectric: X5R; Height: 0.8mm; Capacitance: 1uF; Mount: Surface Mount; Thickness: 0.035inch; Width: 0.031inch; Min Operating Temperature: -55°C; Contact Plating: Tin; Case Code (Imperial): 0603; Depth: 0.8mm; Length: 1.6mm; Max Operating Temperature: 85°C; Packaging: Tape and Reel; Tolerance: 10%; Radiation Hardening: No; Case/Package: 0603; Package Quantity: 1; Voltage Rating: 16V; Case Code (Metric): 1608; Voltage: 16V; Material: Ceramic; Lead Free: Lead Free; Voltage Rating (DC): 16V
C10 = CMP-13271-000387-1: as C29 on sheet ADCS; Depth: 0.5mm; Length: 1mm; Lead Free: Lead Free; Case Code (Metric): 1005; Width: 0.02inch; Min Operating Temperature: -55°C; Thickness: 0.022inch; Package Quantity: 1; Mount: Surface Mount; Height: 0.5mm; Voltage: 50V; Material: Ceramic; Tolerance: 10%; Case Code (Imperial): 0402; Radiation Hardening: No; Case/Package: 0402; Max Operating Temperature: 125°C; Voltage Rating (DC): 50V; Contact Plating: Tin; Packaging: Tape and Reel; Voltage Rating: 50V; Capacitance: 10nF; Dielectric: X7R
C11 = CMP-13271-004127-1: Cap Ceramic 1uF 25V X5R ±10% Pad SMD 0603 +85°C T/R; Height: 0.8mm; Capacitance: 1uF; Depth: 0.8mm; Package Quantity: 1; Mount: Surface Mount; Contact Plating: Tin; Voltage Rating: 25V; Dielectric: X5R; Packaging: Tape and Reel; Material: Ceramic; Case Code (Metric): 1608; Length: 1.6mm; Voltage: 25V; Min Operating Temperature: -55°C; Width: 0.031inch; Tolerance: 10%; Case/Package: 0603; Radiation Hardening: No; Case Code (Imperial): 0603; Thickness: 0.035inch; Lead Free: Lead Free; Max Operating Temperature: 85°C; Voltage Rating (DC): 25V
C12 C16 = CMP-03422-000048-1: CAP CER 0.1UF 16V X7R 0402; Manufacturer: YAGEO; Manufacturer Part Number: CC0402KRX7R7BB104; Material: Ceramic; Automotive Grade: NA; Temperature Coefficient: 30ppm/°C; Tolerance: 0.1; Device Class L1: Passive Components; Temperature Range Low: -55°C; Device Class L3: Ceramic Capacitors; Temperature Characteristic: X7R; Ipc Land Pattern Name: CAPC10050X50; Capacitance: 100 nF; Temperature Range High: +125°C; Voltage Rating: 16 V; Temperature: -55°C to +125°C; RoHS: TRUE; Automotive: No; Height: 0.55mm; Device Class L2: Capacitors; Digikey Description: CAP CER 0.1UF 16V X7R 0402; Package: CC0402; Footprint Url: http://www.yageo.com/exep/pages/download/literatures/UPY-C_GEN_24.pdf; ComponentLink2Description: Datasheet; Category: Cap; Lead Free: Yes; Value: 100 nF; Octopart: https://octopart.com/cc0402krx7r7bb104-yageo-42244624; ComponentLink2URL: http://www.yageo.com/documents/recent/UPY-GP_NP0_16V-to-50V_16.pdf; Mouser Description: 0402 0.1 uF 16 V ±10 % Tolerance X7R SMT Multilayer Ceramic Capacitor
C13 = CMP-03422-000207-1: CAP CER 4.7UF 16V X7R 0805; Manufacturer: Yageo; Manufacturer Part Number: CC0805KKX7R7BB475; Tolerance: 0.1; Material: Ceramic; Footprint Url: http://www.yageo.com/exep/pages/download/literatures/UPY-C_GEN_24.pdf; Device Class L3: Ceramic Capacitors; Temperature: -30°C to +85°C; Device Class L2: Capacitors; Automotive: No; Digikey Description: CAP CER 4.7UF 16V X7R 0805; Temperature Range High: +85°C; Lead Free: Yes; Mouser Description: Multilayer Ceramic Capacitors MLCC - SMD/SMT 4.7M pF 10% 16 Volts; Temperature Characteristic: X7R; Height: 0.95mm; Device Class L1: Passive Components; ComponentLink2Description: Datasheet; Category: Cap; Octopart: https://octopart.com/cc0805kkx7r7bb475-yageo-34429188; Temperature Range Low: -30°C; Package: CC0805-0.85; Ipc Land Pattern Name: CAPC200125X85; RoHS: TRUE; Value: 4.7 uF; Capacitance: 4.7 uF; ComponentLink2URL: http://www.yageo.com/documents/recent/UPY-GPHC_Y5V_6.3V-to-50V_8.pdf; Voltage Rating: 16 V
C14 C15 = CMP-03422-001514-1: CAP CER 20PF 50V C0G/NPO 0603; Dielectric: NP0; Tolerance: 5%; Package Quantity: 1; Number of Pins: 2; RoHS Compliant: Yes; Voltage Rating (DC): 50V; Depth: 0.8mm; Resistor Type: Ceramic; Case Code (Imperial): 0603; Max Operating Temperature: 125°C; Width: 0.031inch; Min Operating Temperature: -55°C; Case Code (Metric): 1608; Length: 0.063inch; Voltage Rating: 50V; Lead Free: Lead Free; Packaging: Tape and Reel; Series: CC; Mount: Surface Mount; Termination: SMD/SMT; Case/Package: 0603; Thickness: 0.035inch; Weight: 7.1E-05oz; Capacitance: 20pF
D1 = CMP-57192-000001-1: LED GREEN CLEAR SMD; Forward Voltage: 2.2V; Test Current: 20mA; Luminous Intensity: 45mcd; Lens Style: Diffused; Number of LEDs: 1; Approvals: UL; Lens Color: Colorless; Dominant Wavelength: 574nm; Viewing Angle: 120°; Lead Free: Lead Free; Case/Package: 0402; Number of Pins: 2; Width: 0.5mm; Min Operating Temperature: -40°C; Case Code (Imperial): 0402; Packaging: Tape and Reel; Color: Green; Max Operating Temperature: 85°C; Case Code (Metric): 1005; Mount: Surface Mount; Length: 1mm; Wavelength: 574nm; Height: 0.5mm; Illumination Color: Green; Lens Transparency: Clear; Package Quantity: 1; Forward Current: 20mA
D2 = CMP-08952-000025-1: LED BLUE CLEAR 1006 SMD; Manufacturer: Rohm; Led Orientation: Top View; Reverse Voltage: 5V; Wavelength: 470nm; Luminous Intensity: 17mcd; Power Dissipation: 66mW; Forward Voltage: 2.9V; Forward Current: 5mA; ComponentLink2URL: https://media.digikey.com/pdf/Data%20Sheets/Rohm%20PDFs/SML-P1_Series_RevB.pdf; ComponentLink2Description: Datasheet; Colour: Blue; RoHS: TRUE; Package: SML-P12; Device Class L1: Optoelectronics; Manufacturer Part Number: SMLP12BC7TT86; Automotive: No; Temperature Range Low: -40°C; Temperature: -40°C to +85°C; Height: 0.25mm; Octopart: https://octopart.com/smlp12bc7tt86-rohm-9290887; Digikey Description: LED BLUE CLEAR 1006 SMD; Lead Free: Yes; Device Class L2: LEDs; Category: Diode; Device Class L3: unset; Mouser Description: ROHM SMLP12BC7TT86, SML-P12 PICOLED Series Blue LED, 1006(0402), Rectangle Lens; Temperature Range High: +85°C
P1 = CMP-2000-07083-1: Male Header, Pitch 1 mm, 1 x 10 Position, Height 1.8 mm, -25 to 85 degC; Manufacturer: JST; Datasheet URL: http://www.jst-mfg.com/product/pdf/eng/eSHL.pdf; Mounting Technology: SurfaceMount; Package Reference: SM10B-SHLS-TF; Manufacturer URL: http://www.jst.com/home2.html; Package Description: Male Header, Pitch 1 mm, 1 x 10 Position, Height 1.8 mm; Datasheet Version: 04/2015
P2 = CMP-2000-07080-1: Male Header, Pitch 1 mm, 1 x 6 Position, Height 2.95 mm, -25 to 85 degC, RoHS, Tape and Reel; Manufacturer: JST; No of Positions: 6; Pitch: 1mm; Style/Orientation: RightAngleHeader/Plug; Datasheet URL: https://datasheet.ciiva.com/26894/getdatasheetpartid-708885-26894671.pdf; Package Description: Male Header, Pitch 1 mm, 1 X 6 Position, Height 2.9 mm; Termination: Solder; Manufacturer URL: http://www.jst.com/home2.html; Type: ShroudedHeader; Package Reference: SM06B-SRSS-TB; Datasheet Version: 11/2010; Mounting Technology: SurfaceMount
Q1 = CMP-14409-000038-1: MOSFET N-CH 60V 265MA TO236AB
R1 = CMP-2002-01154-4: as R22 on sheet ADCS; Height: 0.35 mm; Mounting Technology: Surface Mount; REACH SVHC: Yes; Resistance: 4.7 KOhm; Max Operating Temperature: 155 degC; ComponentLink1Description: Manufacturer URL; ComponentLink2Description: Datasheet; Pins: 2; PackageReference: 0402; Tolerance: 1%; Case Code (Imperial): 0402; Length: 1 mm; PackageDescription: 2-Pin Surface Mount Device, Body 1 x 0.5 mm; RoHSCompliant: true; Package Quantity: 1; Radiation Hardening: No; DatasheetVersion: 04/2015; Width: 0.5 mm; Case Code (Metric): 1005; Mount: Surface Mount; ComponentLink1URL: http://www.panasonic.com/; Min Operating Temperature: -55 degC; Packaging: Cut Tape; ComponentLink2URL: http://industrial.panasonic.com/cdbs/www-data/pdf/RDA0000/AOA0000C86.pdf
R5 = CMP-2000-00179-1: as R33 on sheet ADCS
R7 R14 = CMP-1659-00033-1: Chip Resistor, 22 Ohm, +/- 1%, 0.1 W, -55 to 155 degC, 0603 (1608 Metric), RoHS, Tape and Reel; Max Ouput Current: 8 A; Case\Package: SIP; Max Input Voltage: 1.4 V; ComponentLink2URL: http://www.yageo.com/documents/recent/PYu-RC_Group_51_RoHS_L_04.pdf; RoHSCompliant: true; Max Operating Temperature: 100 degC; PackageDescription: 2-Pin Surface Mount Device, Body 1.6 x 0.8 mm; ComponentLink1Description: Manufacturer URL; ComponentLink1URL: http://www.yageo.com/; Length: 18.5 mm; REACH SVHC: Unknown; Pins: 4; DatasheetVersion: Rev. 4, 02/2016; PackageReference: 0603; Output Current: 8 A; Min Operating Temperature: -25 degC; Height: 19.6 mm; Mount: Through Hole; Radiation Hardening: No; ComponentLink2Description: Datasheet; Package Quantity: 200; Packaging: Rail/Tube
R9-R11 = CMP-2002-01135-4: Chip Resistor, 22 Ohm, +/- 1%, 0.1 W, -55 to 155 degC, 0402 (1005 Metric), RoHS, Tape and Reel; PartNumber: ERJ-2RKF22R0X; Case\/Package: 0402; Resistance: 22 Ohm; Power Rating: 100 mW; Voltage Rating: 50 V; ComponentLink2Description: Datasheet; Packaging: Tape and Reel; Weight: 2.8E-05oz; Pins: 2; Case Code (Imperial): 0402; Width: 0.5 mm; ComponentLink2URL: http://industrial.panasonic.com/cdbs/www-data/pdf/RDA0000/AOA0000C86.pdf; Height: 0.35 mm; PackageReference: 0402; REACH SVHC: Yes; Min Operating Temperature: -55 degC; Length: 1 mm; DatasheetVersion: 04/2015; RoHSCompliant: true; Package Quantity: 10000; Case Code (Metric): 1005; PackageDescription: 2-Pin Surface Mount Device, Body 1 x 0.5 mm; ComponentLink1URL: http://www.panasonic.com/; Mount: Surface Mount; Mounting Technology: Surface Mount; Tolerance: 1%; Max Operating Temperature: 155 degC; ComponentLink1Description: Manufacturer URL
R12 = CMP-2002-07353-1: Part Number: RC0402FR-0710KL; Manufacturer: Yageo / Phycomp
R17 R40 = CMP-2002-00166-1: Manufacturer: Vishay Dale; Part Number: CRCW0402680RFKED
R18 = CMP-2000-07588-1: as R6 on sheet ADCS; RoHSCompliant: True; Lead Free: LeadFree; Package Quantity: 1; Contact Plating: Tin; Length: 1mm; Radiation Hardening: No; REACH SVHC: NoSVHC; Max Operating Temperature: 155degC; Depth: 0.5mm; Case Code (Imperial): 0402; Military Standard: Not; Package Description: 2-Pin Surface Mount Device, Body 1 x 0.5 mm; Termination: SMD/SMT; Case Code (Metric): 1005; Height: 0.35mm; Packaging: TapeandReel; Voltage Rating (DC): 50V; Package Reference: 402; Number of Pins: 2; Tolerance: 1%; Mounting Technology: SurfaceMount; Width: 0.02inch; Mount: SurfaceMount; Datasheet URL: https://industrial.panasonic.com/cdbs/www-data/pdf/RDA0000/AOA0000C304.pdf; Composition: ThickFilm; Datasheet Version: 02/2017; Manufacturer URL: http://www.panasonic.com/; Max Power Dissipation: 100mW; Number of Terminations: 2; Min Operating Temperature: -55degC
R19 = CMP-08839-019445-1: Thick Film Chip Resistor, 0402, 1MΩ, 1%, 100ppm/°C, 0.063W, 50V; Max Power Dissipation: 63mW; Resistance: 1MR; Lead Free: Lead Free; Case Code (Imperial): 0402; Max Operating Temperature: 155°C; Package Quantity: 1; Length: 0.039inch; Temperature Coefficient: 100ppm/°C; Case Code (Metric): 1005; Tolerance: 1%; Case/Package: 0402; RoHS Compliant: Yes; Number of Terminations: 2; Resistor Type: Thick Film; Height: 0.016inch; Packaging: Tape and Reel; Min Operating Temperature: -55°C; Voltage Rating (DC): 50V; Width: 0.02inch; Series: MCR
R20 R21 = CMP-2000-03228-1: Part Number: CRCW060330R0FKEA; Manufacturer: Vishay Dale
SW1 SW2 = CMP-10040-000001-2: SWITCH TACTILE SPST-NO 0.05A 16V; Throw Configuration: SPST; Operating Force: 160gf; Actuator Type: Standard; Switch Travel: 0.15mm; Switch Function: Off-Mom; Max Current Rating: 50mA; Mechanical Life: 150000Cycles; Illumination Type: Non-Illuminated; Package Quantity: 2900; Depth: 4.6mm; Mount: Surface Mount; Packaging: Tape and Reel; Length: 3.2mm; RoHS Compliant: Yes; Case/Package: SMD/SMT; Voltage Rating (DC): 16V; Min Operating Temperature: -40°C; Termination: J-Bend; Lead Free: Lead Free; Contact Plating: Silver; Orientation: Straight; Max Operating Temperature: 85°C; Current Rating: 50mA; Color: Black
U1 = CMP-12105-000007-1: IC MCU 32BIT 512KB FLASH 64LQFP; Manufacturer: ST; Number Of Spi Channels: 4; Ram Size: 128KBytes; Standoff Height: 0.05mm; Number Of Uart Channels: 6; Number Of Pwm Channels: 32; Max Junction Temp: +105°C; Number Of I/Os: 50; Number Of Usb Channels: 2; Frequency: 180MHz; Number Of A/D Converters: 3; Max Supply Voltage: 3.6V; Number Of Adc Channels: 16; Interface: I2C,SPI,UART,USART,CAN,USB,LIN,IrDA,I2S,Other; Memory Size: 512KBytes; Number Of Timers/Counters: 14; Min Supply Voltage: 1.7V; Core Architecture: ARM Cortex-M4; Data Bus Width: 32bits; Number Of Cores: 1; Ambient Temperature Range Low: -40°C; ComponentLink2URL: https://www.st.com/en/microcontrollers-microprocessors/stm32f446re.html; Category: IC; Height: 1.6mm; Ipc Land Pattern Name: QFP50P1200X1200X160-64; Manufacturer Part Number: STM32F446RET6; Octopart: https://octopart.com/stm32f446ret6-stmicroelectronics-52642920; Temperature Range High: +105°C; Lead Free: Yes; Mouser Description: ARM Microcontrollers - MCU High-performance and DSP with FP, ARM Cortex-M4 MCU with 512 Kbytes Flash, 180 MHz CPU, Art Accelerator, SDRAM; Digikey Description: IC MCU 32BIT 512KB FLASH 64LQFP; Ambient Temperature Range High: +85°C; Number Of I2C Channels: 4; Memory Type: FLASH; RoHS: TRUE; Automotive: No; Device Class L1: Integrated Circuits (ICs); Temperature: -40°C to +105°C; Device Class L2: Embedded Processors and Controllers; Device Class L3: Microcontrollers; Temperature Range Low: -40°C; Package: LQFP64-5W; ComponentLink2Description: Datasheet
X1 = CMP-2000-05036-1: Low Frequency Crystal, 32.768 KHz, 6 pF, +/- 20 ppm, -40 to 85 degC, 4-Pin SMD, RoHS, Tape and Reel; Manufacturer: Abracon; Tolerance: 20PPM; ESR: 50kOhms; Case Width: 3.8mm; Case Height: 2.5mm; Case Length: 8mm; Load Capacitance: 6pF; Operating Temperature Range: -40Cto+85C; Package Reference: ABS25; Factory Pack Quantity: 3000; Package Description: 4-Pin Surface Mount Device, Body 8 x 3.8 mm, Pitch 5.5 mm; Frequency: 32.768kHz; Termination Style: SMD/SMT; Manufacturer URL: http://www.abracon.com/; Type: LowFrequencyCrystal; Dimensions: 3.8mmWx8mmLx2.5mmH; Product Category: Crystals; Series: ABS25; RoHS: Details; Package / Case: 8mmx3.8mm; Datasheet Version: Jun-17; Brand: ABRACON; Datasheet URL: https://datasheet.ciiva.com/854/abs25-854528.pdf; Packaging: Reel; Mounting Style: SMD/SMT
X2 = CMP-2000-05033-2: Crystal 8MHz ±20ppm 18pF SMD-2 5mm x 3.2mm; Series Resistance: 500R; Frequency Stability: 30ppm; ESR (Equivalent Series Resistance): 140R; Load Capacitance: 18pF; Height: 0.051inch; Tolerance: 20ppm; Depth: 3.2mm; Max Operating Temperature: 85°C; Frequency: 8MHz; Termination: SMD/SMT; Lead Free: Lead Free; Number of Pins: 2; Width: 3.2mm; RoHS Compliant: Yes; Resistor Type: Ceramic; Length: 5mm; Mount: Surface Mount; Case/Package: CSMD; Package Quantity: 1000; Radiation Hardening: No; Min Operating Temperature: -40°C; Packaging: Tape and Reel; Frequency Tolerance: 20ppm